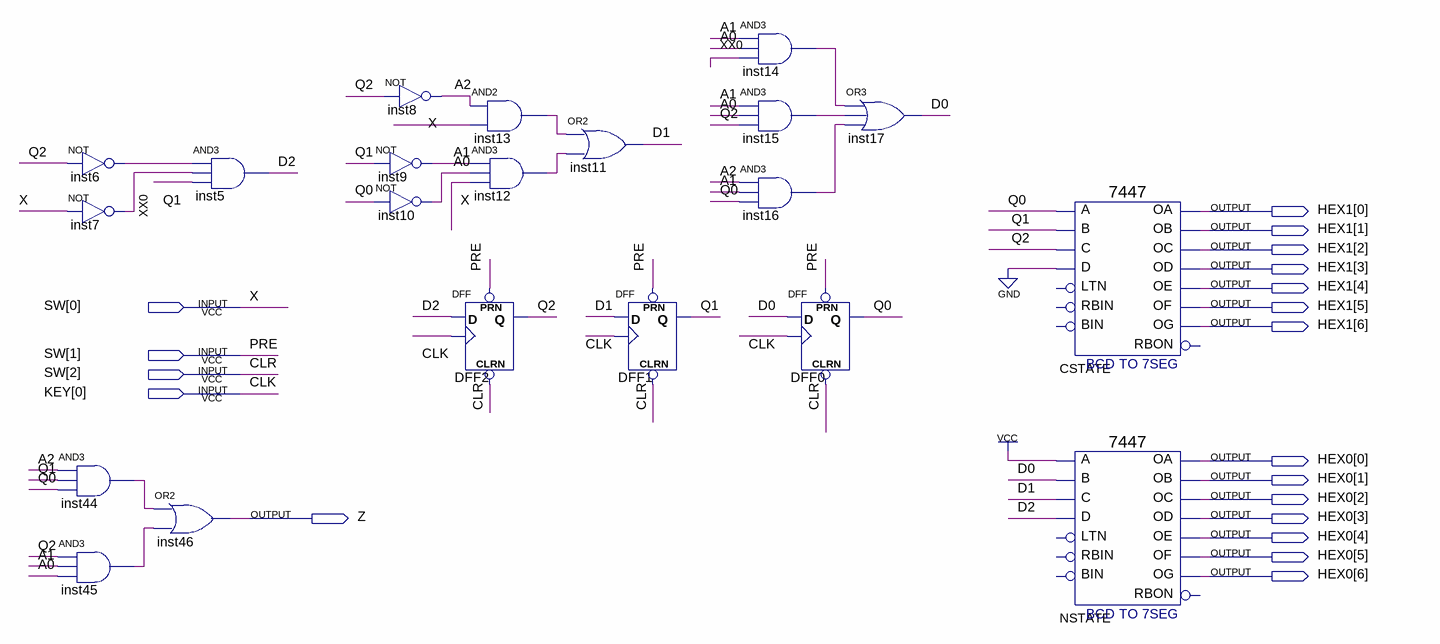
[diagram p0: schematic sheet]
// Quartus schematic Lab2.bdf as structural Verilog: 21 symbols, 19 pins
module Lab2 (
  input  [2:0] SW,
  input  [0:0] KEY,
  output [6:0] HEX1,
  output [6:0] HEX0,
  output Z
);

  wire A0, A1, A2, D0, D1, D2, inst6_out, inst12_out, inst13_out, inst14_out, inst15_out, inst16_out,
       inst44_out, inst45_out, Q0, Q1, Q2, XX0;

  and inst44 (inst44_out, A2, Q1, Q0);
  and inst45 (inst45_out, Q2, A1, A0);
  not inst6 (inst6_out, Q2);
  not inst7 (XX0, SW[0]);
  and inst5 (D2, inst6_out, XX0, Q1);
  or inst46 (Z, inst44_out, inst45_out);
  not inst8 (A2, Q2);
  not inst9 (A1, Q1);
  not inst10 (A0, Q0);
  and inst13 (inst13_out, A2, SW[0]);
  and inst12 (inst12_out, A1, A0, SW[0]);
  DFF DFF2 (.CLRN(SW[2]), .CLK(KEY[0]), .D(D2), .PRN(SW[1]), .Q(Q2));
  or inst11 (D1, inst13_out, inst12_out);
  DFF DFF1 (.CLRN(SW[2]), .CLK(KEY[0]), .D(D1), .PRN(SW[1]), .Q(Q1));
  and inst14 (inst14_out, A1, A0, XX0);
  and inst15 (inst15_out, A1, A0, Q2);
  and inst16 (inst16_out, A2, A1, Q0);
  DFF DFF0 (.CLRN(SW[2]), .CLK(KEY[0]), .D(D0), .PRN(SW[1]), .Q(Q0));
  or inst17 (D0, inst14_out, inst15_out, inst16_out);
  \7447  CSTATE (
    .B(Q1), .C(Q2), .D(1'b0), .A(Q0), .OB(HEX1[1]), .OC(HEX1[2]), .OE(HEX1[4]), .OD(HEX1[3]), .OF(HEX1[5]),
    .OG(HEX1[6]), .OA(HEX1[0]));  // open: LTN, RBIN, BIN, RBON
  \7447  NSTATE (
    .B(D0), .C(D1), .D(D2), .A(1'b1), .OB(HEX0[1]), .OC(HEX0[2]), .OE(HEX0[4]), .OD(HEX0[3]), .OF(HEX0[5]),
    .OG(HEX0[6]), .OA(HEX0[0]));  // open: LTN, RBIN, BIN, RBON

  // Other names for the same wires on the sheet: CLK = KEY[0]; CLR = SW[2]; PRE = SW[1]; X = SW[0]
endmodule
